# EAGLE schematic LED (EAGLE 7.2.0)
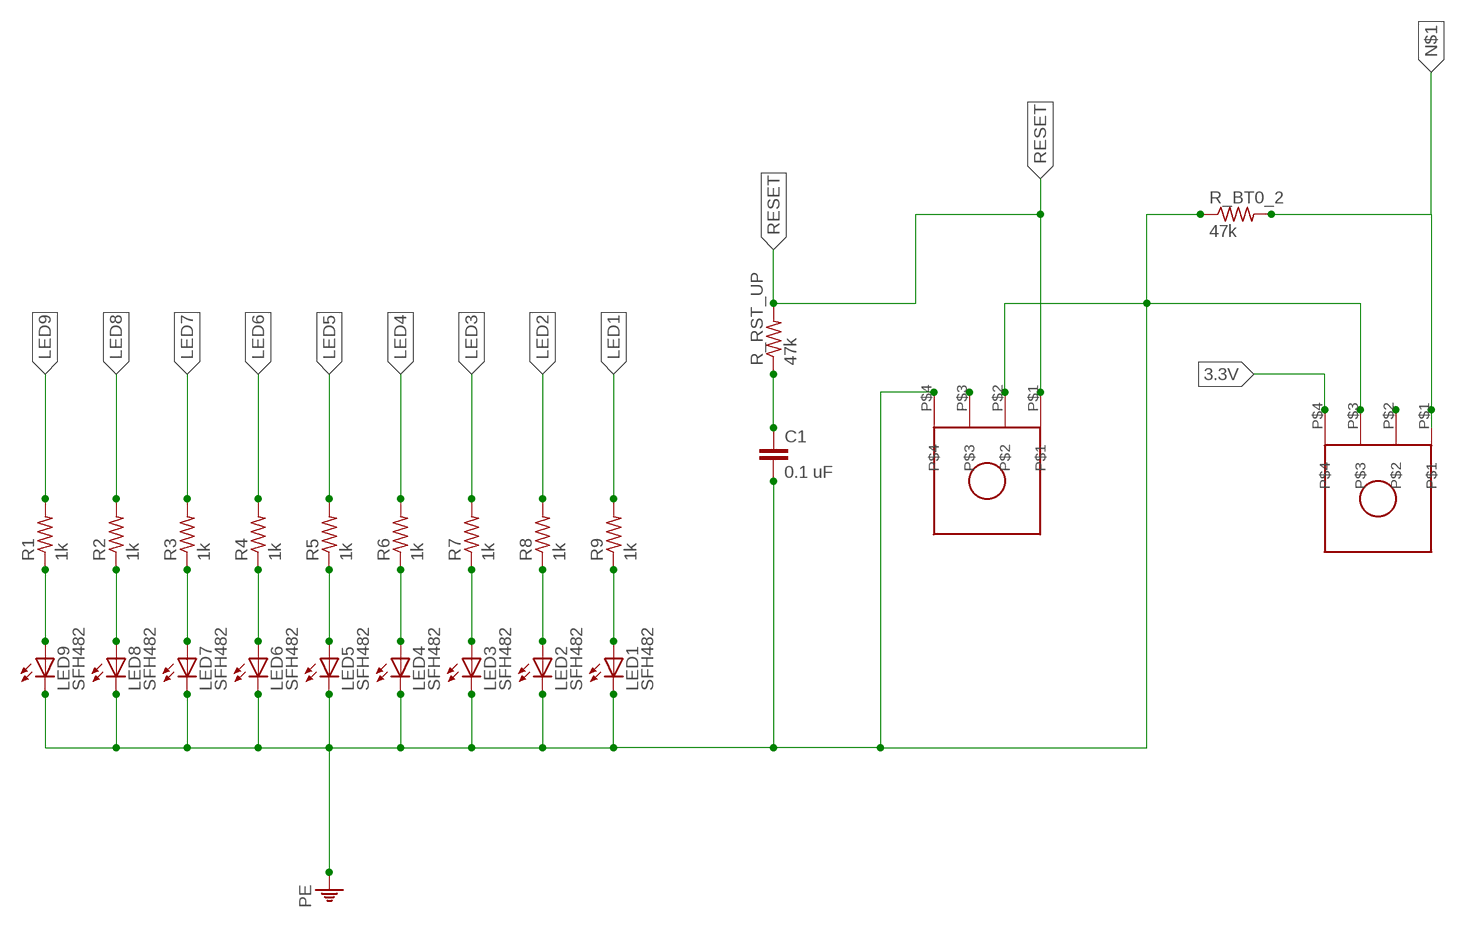
[diagram p0: schematic, sheet 1]

## Parts
1  MMBUTTON  [MMBUTTON]
C1  0.1 uF  C-EUC0805K  [C0805K]
LED1  SFH482  [SFH482]
LED2  SFH482  [SFH482]
LED3  SFH482  [SFH482]
LED4  SFH482  [SFH482]
LED5  SFH482  [SFH482]
LED6  SFH482  [SFH482]
LED7  SFH482  [SFH482]
LED8  SFH482  [SFH482]
LED9  SFH482  [SFH482]
R1  1k  R-US_R0805W  [R0805W]
R2  1k  R-US_R0805W  [R0805W]
R3  1k  R-US_R0805W  [R0805W]
R4  1k  R-US_R0805W  [R0805W]
R5  1k  R-US_R0805W  [R0805W]
R6  1k  R-US_R0805W  [R0805W]
R7  1k  R-US_R0805W  [R0805W]
R8  1k  R-US_R0805W  [R0805W]
R9  1k  R-US_R0805W  [R0805W]
R_BT0_2  47k  R-US_R1206  [R1206]
R_RST_UP  47k  R-US_R1206  [R1206]
U$1  MMBUTTON  [MMBUTTON]

## Nets
3.3V: U$1.P$4
LED1: R9.2
LED2: R8.2
LED3: R7.2
LED4: R6.2
LED5: R5.2
LED6: R4.2
LED7: R3.2
LED8: R2.2
LED9: R1.2
N$1: R_BT0_2.2 U$1.P$1
N$2: 1.P$3
N$3: C1.1 R_RST_UP.1
N$6: U$1.P$2
N$19: LED1.A R9.1
N$22: LED2.A R8.1
N$24: LED3.A R7.1
N$25: LED4.A R6.1
N$28: LED5.A R5.1
N$30: LED6.A R4.1
N$32: LED7.A R3.1
N$33: LED8.A R2.1
N$36: LED9.A R1.1
PE: 1.P$2 1.P$4 C1.2 LED1.K(C) LED2.K(C) LED3.K(C) LED4.K(C) LED5.K(C) LED6.K(C) LED7.K(C) LED8.K(C) LED9.K(C) R_BT0_2.1 U$1.P$3
RESET: 1.P$1 R_RST_UP.2

## Library data of the parts
1 U$1 = MMButton:MMBUTTON
C1 = resistor:C-EU: CAPACITOR, European symbol
LED1-LED9 = led:SFH482: IR LED infrared emitting diode, Infineon
R1-R9 R_BT0_2 R_RST_UP = resistor:R-US_: RESISTOR, American symbol